# Altium project PCB Exericise.PrjPcb
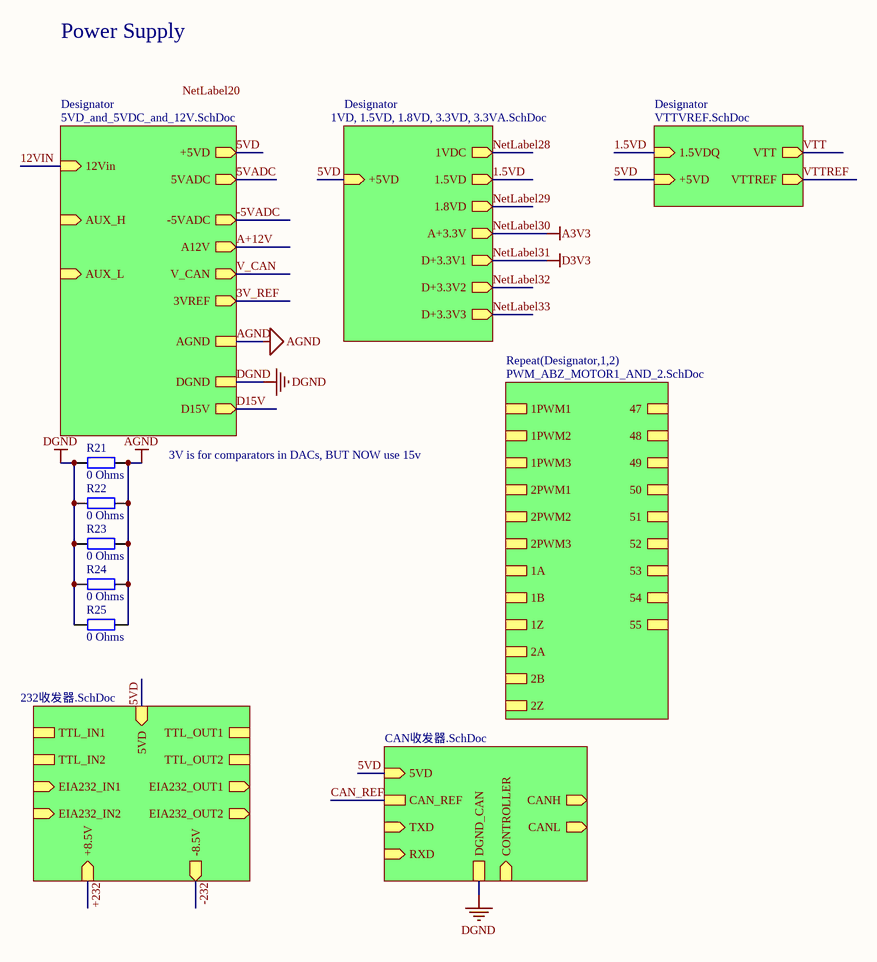
[diagram p0: POWER_BOARD.SchDoc]
10 sheets, 254 parts. Net scope: hierarchical (ports join the sheet entries above them; power ports are global).
Sheets:
  POWER_BOARD.SchDoc
    Designator = 1VD, 1.5VD, 1.8VD, 3.3VD, 3.3VA.SchDoc
    Designator = VTTVREF.SchDoc
    Designator = 5VD_and_5VDC_and_12V.SchDoc
    Designator = 232收发器.SchDoc
    CANH = CAN收发器.SchDoc
    Designator1 = PWM_ABZ_MOTOR1_AND_2.SchDoc
      ABZ1 = ABZ_M1_M2.SchDoc
      ABZ2 = ABZ_M1_M2.SchDoc
      ABZ3 = ABZ_M1_M2.SchDoc
      ABZ4 = ABZ_M1_M2.SchDoc
      ABZ5 = ABZ_M1_M2.SchDoc
      ABZ6 = ABZ_M1_M2.SchDoc
      ABZ7 = ABZ_M1_M2.SchDoc
      ABZ8 = ABZ_M1_M2.SchDoc
      ABZ9 = ABZ_M1_M2.SchDoc
      ABZ10 = ABZ_M1_M2.SchDoc
      ABZ11 = ABZ_M1_M2.SchDoc
      Drive1 = SN74HC245.SchDoc
      Drive2 = SN74HC245.SchDoc
      Drive3 = SN74HC245.SchDoc
      Drive4 = SN74HC245.SchDoc
      Drive5 = SN74HC245.SchDoc
    Designator2 = PWM_ABZ_MOTOR1_AND_2.SchDoc
      ABZ1 = ABZ_M1_M2.SchDoc
      ABZ2 = ABZ_M1_M2.SchDoc
      ABZ3 = ABZ_M1_M2.SchDoc
      ABZ4 = ABZ_M1_M2.SchDoc
      ABZ5 = ABZ_M1_M2.SchDoc
      ABZ6 = ABZ_M1_M2.SchDoc
      ABZ7 = ABZ_M1_M2.SchDoc
      ABZ8 = ABZ_M1_M2.SchDoc
      ABZ9 = ABZ_M1_M2.SchDoc
      ABZ10 = ABZ_M1_M2.SchDoc
      ABZ11 = ABZ_M1_M2.SchDoc
      Drive1 = SN74HC245.SchDoc
      Drive2 = SN74HC245.SchDoc
      Drive3 = SN74HC245.SchDoc
      Drive4 = SN74HC245.SchDoc
      Drive5 = SN74HC245.SchDoc
  PWM_M1_M2.SchDoc

## Sheet POWER_BOARD.SchDoc
size A4; SheetNumber: 1; SheetTotal: 10

### Parts
R21  0 Ohms  [R 0805_L]
R22  0 Ohms  [R 0805_L]
R23  0 Ohms  [R 0805_L]
R24  0 Ohms  [R 0805_L]
R25  0 Ohms  [R 0805_L]

### Sub-sheets
CANH = CAN收发器.SchDoc: 5VD (in), CAN_REF, TXD (in), RXD (in), CONTROLLER (in), CANL (out), CANH (out), DGND_CAN
Designator = 1VD, 1.5VD, 1.8VD, 3.3VD, 3.3VA.SchDoc: +5VD (in), 1VDC (out), 1.5VD (out), 1.8VD (out), A+3.3V (out), D+3.3V1 (out), D+3.3V2 (out), D+3.3V3 (out)
Designator = VTTVREF.SchDoc: 1.5VDQ (in), VTT (out), VTTREF (out), +5VD (in)
Designator = 5VD_and_5VDC_and_12V.SchDoc: +5VD (out), 12Vin (in), 5VADC (out), A12V (out), -5VADC (out), V_CAN (out), 3VREF (out), AGND, DGND, AUX_H (in), AUX_L (in), D15V (out)
Designator = 232收发器.SchDoc: TTL_IN1, TTL_IN2, TTL_OUT1, TTL_OUT2, +8.5V (in), EIA232_IN1 (in), EIA232_IN2 (in), EIA232_OUT1 (out), EIA232_OUT2 (out), 5VD (in), -8.5V (out)
Repeat(Designator,1,2) = PWM_ABZ_MOTOR1_AND_2.SchDoc: 1PWM1, 1PWM2, 1PWM3, 2PWM1, 2PWM2, 2PWM3, 1A, 1B, 1Z, 47, 48, 49, 50, 51, 52, 53, 54, 55, 2A, 2B, 2Z

### Nets
1.5VD: sheet Designator/1.5VD, sheet Designator/1.5VDQ
5VD: sheet Designator/+5VD, sheet Designator/+5VD, sheet Designator/+5VD, sheet Designator/5VD, sheet CANH/5VD
AGND: R21.2 R22.2 R23.2 R24.2 R25.2 ; sheet Designator/AGND
DGND: R21.1 R22.1 R23.1 R24.1 R25.1 ; sheet Designator/DGND, sheet CANH/DGND_CAN

### Notes on the sheet
- Power Supply
- 3V is for comparators in DACs, BUT NOW use 15v
- Labels drawn without touching a wire or pin: NetLabel20

### Library data of the parts
R21-R25 = R: 贴片电阻; 版权归属: 来自淘宝 ID：黄晶宝石; 封装库来自淘宝卖家 ID：黄晶宝石: 其他店铺购入均为盗版，不享受售后技术支持服务，请立即申请退款; BOM名称: 贴片电阻; 联系售后: https://shop463601444.taobao.com

## Sheet 1VD, 1.5VD, 1.8VD, 3.3VD, 3.3VA.SchDoc
size 381 x 241 mm; SheetNumber: 3; SheetTotal: 7
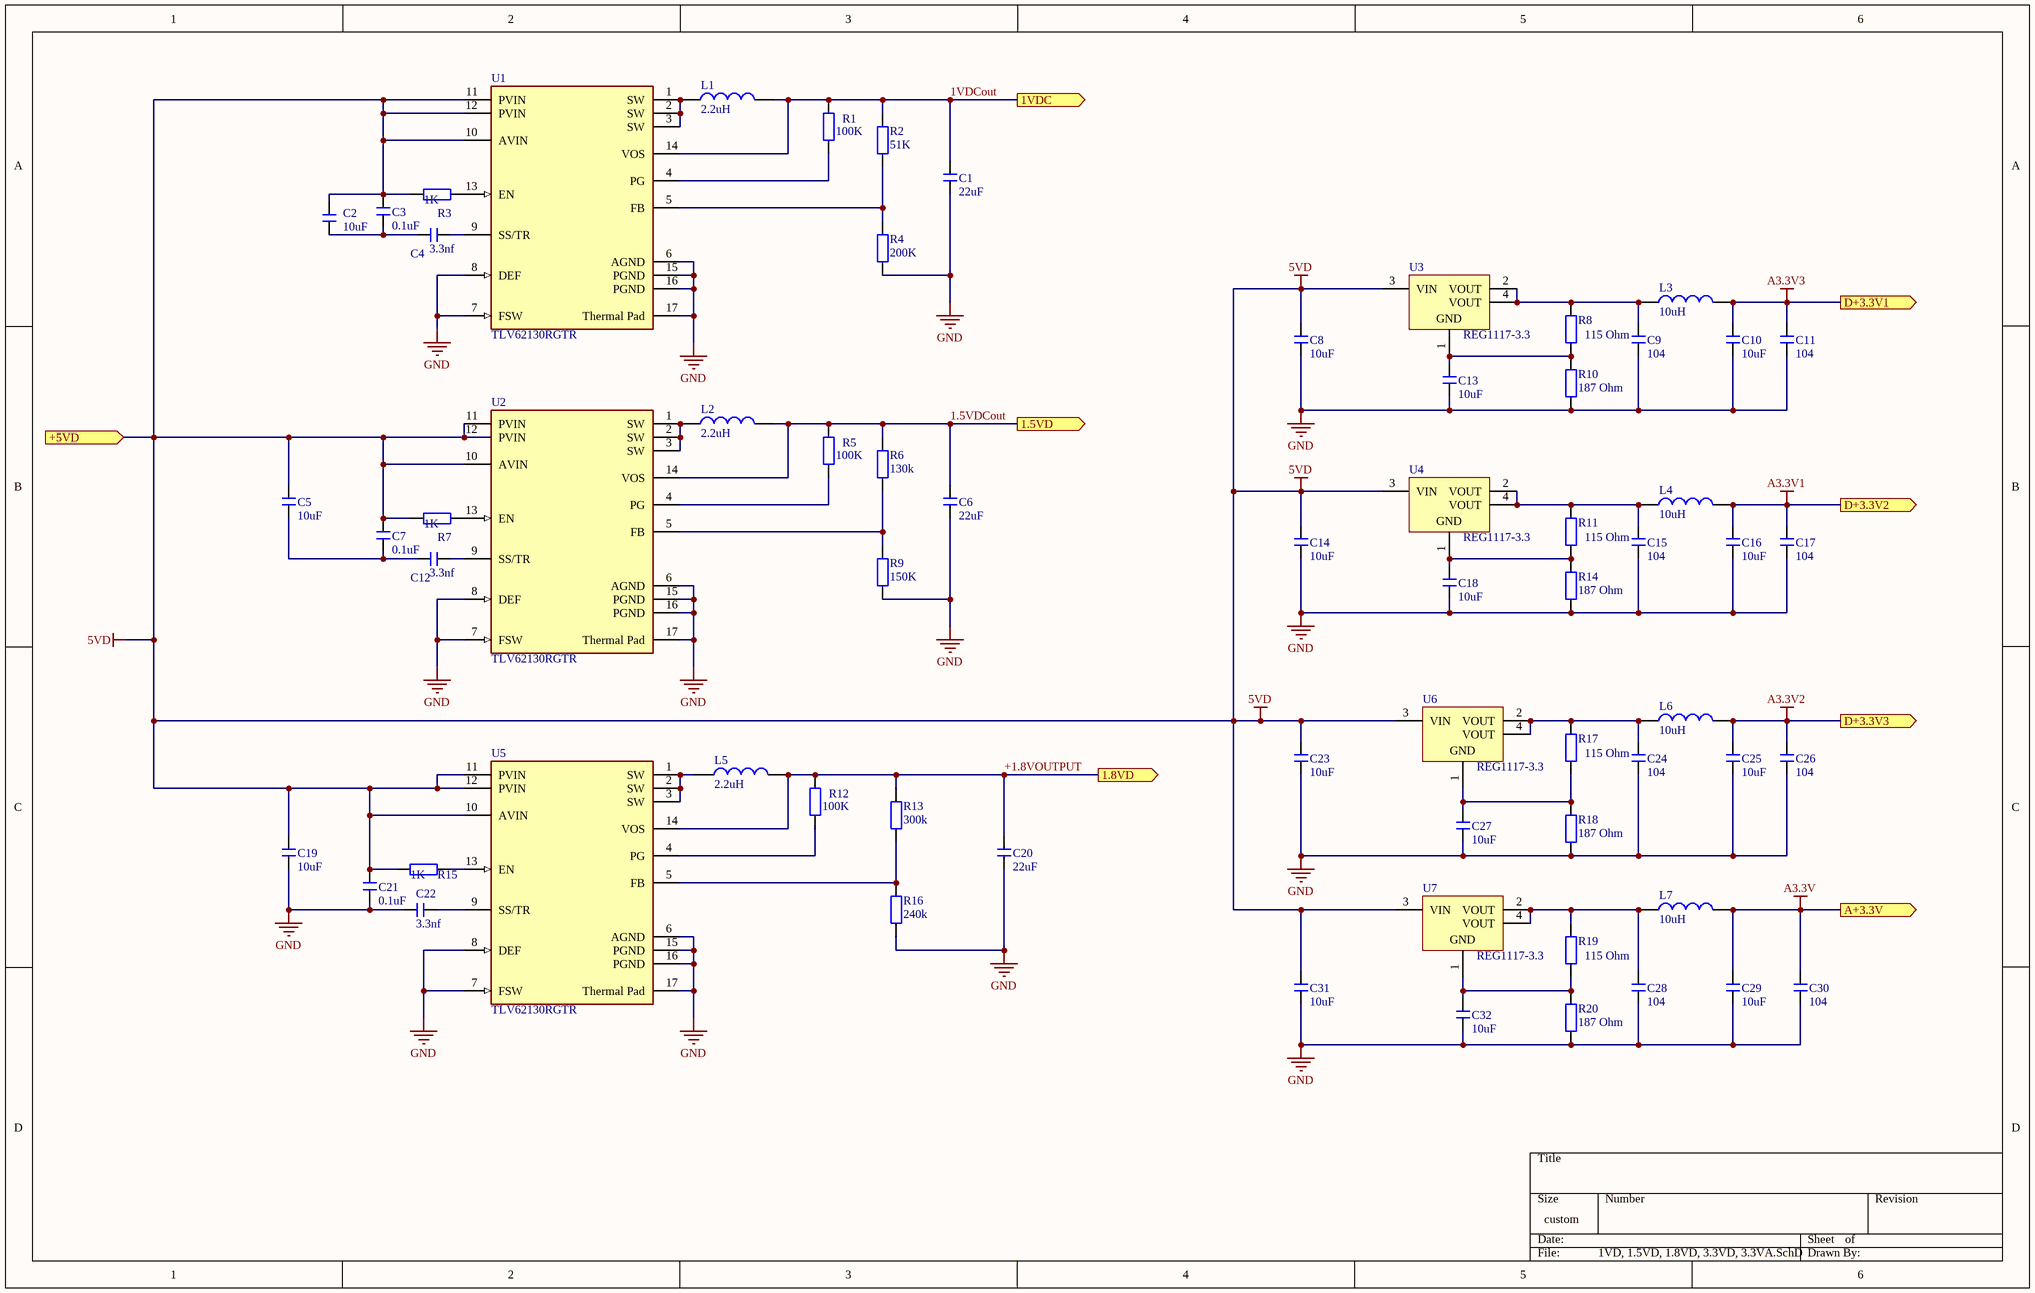
[diagram p1: 1VD, 1.5VD, 1.8VD, 3.3VD, 3.3VA.SchDoc]

### Parts
C1  22uF  [C 0805_L]
C2  10uF  [C 0805_L]
C3  0.1uF  [C 0805_L]
C4  3.3nf  [C 0805_L]
C5  10uF  [C 0805_L]
C6  22uF  [C 0805_L]
C7  0.1uF  [C 0805_L]
C8  10uF  [C 0805_L]
C9  104  [C 0805_L]
C10  10uF  [C 0805_L]
C11  104  [C 0805_L]
C12  3.3nf  [C 0805_L]
C13  10uF  [C 0805_L]
C14  10uF  [C 0805_L]
C15  104  [C 0805_L]
C16  10uF  [C 0805_L]
C17  104  [C 0805_L]
C18  10uF  [C 0805_L]
C19  10uF  [C 0805_L]
C20  22uF  [C 0805_L]
C21  0.1uF  [C 0805_L]
C22  3.3nf  [C 0805_L]
C23  10uF  [C 0805_L]
C24  104  [C 0805_L]
C25  10uF  [C 0805_L]
C26  104  [C 0805_L]
C27  10uF  [C 0805_L]
C28  104  [C 0805_L]
C29  10uF  [C 0805_L]
C30  104  [C 0805_L]
C31  10uF  [C 0805_L]
C32  10uF  [C 0805_L]
L1  2.2uH  [L 0805]
L2  2.2uH  [L 0805]
L3  10uH  [AL0307]
L4  10uH  [AL0307]
L5  2.2uH  [L 0805]
L6  10uH  [AL0307]
L7  10uH  [AL0307]
R1  100K  [R 0805_L]
R2  51K  [R 0805_L]
R3  1K  [R 0805_L]
R4  200K  [R 0805_L]
R5  100K  [R 0805_L]
R6  130k  [R 0805_L]
R7  1K  [R 0805_L]
R8  115 Ohm  [R 0805_L]
R9  150K  [R 0805_L]
R10  187 Ohm  [R 0805_L]
R11  115 Ohm  [R 0805_L]
R12  100K  [R 0805_L]
R13  300k  [R 0805_L]
R14  187 Ohm  [R 0805_L]
R15  1K  [R 0805_L]
R16  240k  [R 0805_L]
R17  115 Ohm  [R 0805_L]
R18  187 Ohm  [R 0805_L]
R19  115 Ohm  [R 0805_L]
R20  187 Ohm  [R 0805_L]
U1  TLV62130RGTR  [FP-RGT0016C-IPC_A]
U2  TLV62130RGTR  [FP-RGT0016C-IPC_A]
U3  REG1117-3.3  [DCY0004A_M]
U4  REG1117-3.3  [DCY0004A_M]
U5  TLV62130RGTR  [FP-RGT0016C-IPC_A]
U6  REG1117-3.3  [DCY0004A_M]
U7  REG1117-3.3  [DCY0004A_M]

### Ports
1.5VD (out, see POWER_BOARD[2A]), 1.8VD (out, see POWER_BOARD[2A]), 1VDC (out, see POWER_BOARD[2A]), +5VD (in, see POWER_BOARD[1A], 5VD_and_5VDC_and_12V[3B], VTTVREF[1B]), A+3.3V (out, see POWER_BOARD[2B]), D+3.3V1 (out, see POWER_BOARD[2B]), D+3.3V2 (out, see POWER_BOARD[2B]), D+3.3V3 (out, see POWER_BOARD[2B])

### Nets
1.5VDCout: C6.2 L2.2 R5.2 R6.2 U2.14(VOS) ; port 1.5VD  [project net 1.5VD]
5VD: C2.2 C3.2 C5.2 C7.2 C8.2 C14.2 C19.2 C21.2 C23.2 C31.2 R3.1 R7.1 R15.1 U1.10(AVIN) U1.11(PVIN) U1.12(PVIN) U2.10(AVIN) U2.11(PVIN) U2.12(PVIN) U3.3(VIN) U4.3(VIN) U5.10(AVIN) U5.11(PVIN) U5.12(PVIN) U6.3(VIN) U7.3(VIN) ; port +5VD
A3.3V: C29.2 C30.2 L7.2 ; port A+3.3V  [project net NetLabel30]
A3.3V1: C16.2 C17.2 L4.2 ; port D+3.3V2  [project net NetLabel32]
A3.3V2: C25.2 C26.2 L6.2 ; port D+3.3V3  [project net NetLabel33]
A3.3V3: C10.2 C11.2 L3.2 ; port D+3.3V1  [project net 1A_IN]
GND: C1.1 C6.1 C8.1 C9.1 C10.1 C11.1 C13.1 C14.1 C15.1 C16.1 C17.1 C18.1 C19.1 C20.1 C21.1 C22.1 C23.1 C24.1 C25.1 C26.1 C27.1 C28.1 C29.1 C30.1 C31.1 C32.1 R4.1 R9.1 R10.1 R14.1 R16.1 R18.1 R20.1 U1.6(AGND) U1.7(FSW) U1.8(DEF) U1.15(PGND) U1.16(PGND) U1.17(Thermal_Pad) U2.6(AGND) U2.7(FSW) U2.8(DEF) U2.15(PGND) U2.16(PGND) U2.17(Thermal_Pad) U5.6(AGND) U5.7(FSW) U5.8(DEF) U5.15(PGND) U5.16(PGND) U5.17(Thermal_Pad)
1VDCout: C1.2 L1.2 R1.2 R2.2 U1.14(VOS) ; port 1VDC
+1.8VOUTPUT: C20.2 L5.2 R12.2 R13.2 U5.14(VOS) ; port 1.8VD
NetC2_1: C2.1 C3.1 C4.1
NetC4_2: C4.2 U1.9(SS/TR)
NetC5_1: C5.1 C7.1 C12.1
NetC9_2: C9.2 L3.1 R8.2 U3.2(VOUT) U3.4(VOUT)
NetC12_2: C12.2 U2.9(SS/TR)
NetC13_2: C13.2 R8.1 R10.2 U3.1(GND)
NetC15_2: C15.2 L4.1 R11.2 U4.2(VOUT) U4.4(VOUT)
NetC18_2: C18.2 R11.1 R14.2 U4.1(GND)
NetC22_2: C22.2 U5.9(SS/TR)
NetC24_2: C24.2 L6.1 R17.2 U6.2(VOUT) U6.4(VOUT)
NetC27_2: C27.2 R17.1 R18.2 U6.1(GND)
NetC28_2: C28.2 L7.1 R19.2 U7.2(VOUT) U7.4(VOUT)
NetC32_2: C32.2 R19.1 R20.2 U7.1(GND)
NetL1_1: L1.1 U1.1(SW) U1.2(SW) U1.3(SW)
NetL2_1: L2.1 U2.1(SW) U2.2(SW) U2.3(SW)
NetL5_1: L5.1 U5.1(SW) U5.2(SW) U5.3(SW)
NetR1_1: R1.1 U1.4(PG)
NetR2_1: R2.1 R4.2 U1.5(FB)
NetR3_2: R3.2 U1.13(EN)
NetR5_1: R5.1 U2.4(PG)
NetR6_1: R6.1 R9.2 U2.5(FB)
NetR7_2: R7.2 U2.13(EN)
NetR12_1: R12.1 U5.4(PG)
NetR13_1: R13.1 R16.2 U5.5(FB)
NetR15_2: R15.2 U5.13(EN)

### Library data of the parts
C1 C6 = C: 贴片电容 22 µF, 6.3 V, Ceramic, 0805 Standard; BOM名称: 无极性贴片电容; 淘宝ID: 封装库来自淘宝 ID：黄晶宝石; 联系售后，技术支持: https://shop463601444.taobao.com; 唯一出售店铺网址: https://shop463601444.taobao.com
C2 C5 = C: 贴片电容 10 µF, 25 V, Ceramic, 1210 Standard; BOM名称: 无极性贴片电容; 淘宝ID: 封装库来自淘宝 ID：黄晶宝石; 联系售后，技术支持: https://shop463601444.taobao.com; 唯一出售店铺网址: https://shop463601444.taobao.com
C3 = C: 贴片电容 / C7 0.1 µF, 25V, Ceramic, 0603; BOM名称: 无极性贴片电容; 淘宝ID: 封装库来自淘宝 ID：黄晶宝石; 联系售后，技术支持: https://shop463601444.taobao.com; 唯一出售店铺网址: https://shop463601444.taobao.com
C4 C12 C22 = C: 贴片电容 3300 pF, 25 V, Ceramic, 0603; BOM名称: 无极性贴片电容; 淘宝ID: 封装库来自淘宝 ID：黄晶宝石; 联系售后，技术支持: https://shop463601444.taobao.com; 唯一出售店铺网址: https://shop463601444.taobao.com
C7 = C: 贴片电容 0.1 µF, 25V, Ceramic, 0603; BOM名称: 无极性贴片电容; 淘宝ID: 封装库来自淘宝 ID：黄晶宝石; 联系售后，技术支持: https://shop463601444.taobao.com; 唯一出售店铺网址: https://shop463601444.taobao.com
C8-C11 C13-C18 C21 C23-C32 = C: 贴片电容; BOM名称: 无极性贴片电容; 淘宝ID: 封装库来自淘宝 ID：黄晶宝石; 联系售后，技术支持: https://shop463601444.taobao.com; 唯一出售店铺网址: https://shop463601444.taobao.com
C19 = C: 贴片电容 10 µF, 25 V, Ceramic, 1210; BOM名称: 无极性贴片电容; 淘宝ID: 封装库来自淘宝 ID：黄晶宝石; 联系售后，技术支持: https://shop463601444.taobao.com; 唯一出售店铺网址: https://shop463601444.taobao.com
C20 = C: 贴片电容 22 µF, 6.3 V, Ceramic, 0805; BOM名称: 无极性贴片电容; 淘宝ID: 封装库来自淘宝 ID：黄晶宝石; 联系售后，技术支持: https://shop463601444.taobao.com; 唯一出售店铺网址: https://shop463601444.taobao.com
L1 L2 = L: 小功率贴片电感 2.2 µH, 0.165 × 0.165 in XFL4020-222MEB, Coilcraft; 淘宝ID: 封装库来自淘宝 ID：黄晶宝石; 封装库来自淘宝卖家 ID：黄晶宝石: 其他店铺购入均为盗版，不享受售后技术支持服务，请立即申请退款; BOM名称: 小功率贴片电感; 联系售后: https://shop463601444.taobao.com
L3 L4 L6 L7 = L-AL: 色环电感; 淘宝ID: 封装库来自淘宝 ID：黄晶宝石; BOM名称: 色环电感; 学习资源: https://shop463601444.taobao.com
L5 = L: 小功率贴片电感; 淘宝ID: 封装库来自淘宝 ID：黄晶宝石; 封装库来自淘宝卖家 ID：黄晶宝石: 其他店铺购入均为盗版，不享受售后技术支持服务，请立即申请退款; BOM名称: 小功率贴片电感; 联系售后: https://shop463601444.taobao.com
R1 R5 = R: 贴片电阻 100 kΩ, Chip, 0603, 1/16W, 1%; 版权归属: 来自淘宝 ID：黄晶宝石; 封装库来自淘宝卖家 ID：黄晶宝石: 其他店铺购入均为盗版，不享受售后技术支持服务，请立即申请退款; BOM名称: 贴片电阻; 联系售后: https://shop463601444.taobao.com
R2 R4 R6 R8-R14 R16-R20 = R: as R21 on sheet POWER_BOARD; BOM名称: 贴片电阻; 联系售后: https://shop463601444.taobao.com
R3 R7 R15 = R: 贴片电阻R1 IMPORTANT, TO PREVENT HV DAMAGE; BOM名称: 贴片电阻; 版权归属: 来自淘宝 ID：黄晶宝石; 封装库来自淘宝卖家 ID：黄晶宝石: 其他店铺购入均为盗版，不享受售后技术支持服务，请立即申请退款; 联系售后: https://shop463601444.taobao.com
U1 U2 U5 = CMP-04918-000039-1: IC REG BUCK ADJUSTABLE 3A 16QFN; Manufacturer: Texas Instruments; Min Supply Voltage: 3V; Max Junction Temp: +125°C; Output Type: AdjustableProgrammable; Number Of Outputs: 1; Nominal Supply Current: 19uA; Standoff Height: 0mm; Max Supply Voltage: 17V; Switching Frequency: 1.25/2.5MHz; Max Duty Cycle: 100%; Output Voltage: 0.9-5.5V; ComponentLink2Description: Datasheet; Category: IC; Manufacturer Part Number: TLV62130RGTR; Mouser Description: Switching Voltage Regulators 4-17V 3A Step-Down Converter; Output Current: 3A; Ambient Temperature Range Low: -40°C; Package: RGT0016C; Lead Free: Yes; Temperature Range Low: -40°C; Digikey Description: IC REG BUCK ADJUSTABLE 3A 16QFN; Height: 1mm; Device Class L3: Voltage Regulators - Switching; Device Class L1: Integrated Circuits (ICs); Switching Topology: Buck; Ambient Temperature Range High: +85°C; RoHS: TRUE; Ipc Land Pattern Name: QFN50P300X300X100-16; Temperature: -40°C to +85°C; Octopart: https://octopart.com/tlv62130rgtr-texas+instruments-21766117; Device Class L2: Power Management ICs; Temperature Range High: +85°C; Automotive: No; ComponentLink2URL: http://www.ti.com/lit/ds/symlink/tlv62130.pdf
U3 U4 U6 U7 = CMP-0395-00549-2: Single Output LDO, 800 mA, Fixed 3.3 V Output, 3.8 to 15 V Input, with Internal Current Limiting, 4-pin SOT-223 (DCY), -40 to 125 degC, Green (RoHS & no Sb/Br); Manufacturer: Texas Instruments; Vout Adj(Max)(V): 3.3; Vin(Max)(V): 15; Iq(Typ)(mA): 4; Iout(Max)(A): 0.8; Vdo(Typ)(mV): 1100; Vin(Min)(V): 3.8; SubFamily: Single Channel LDO; Rating: Catalog; Fixed Output Options(V): 5; ComponentLink1Description: Manufacturer URL; Eco-Plan: Green (RoHS & no Sb/Br); PackageReference: DCY0004A; Mounting Technology: Surface Mount; ComponentLink3Description: Package Specification; Vout Adj(Min)(V): 3.3; ComponentLink2URL: http://www.ti.com/general/docs/lit/getliterature.tsp?genericPartNumber=REG1117-33&fileType=pdf; PackageVersion: 4202506/B; ComponentLink3URL: http://www.ti.com/litv/pdf/mpds094a; Code_JEDEC: TO-261; ComponentLink1URL: http://www.ti.com/; ComponentLink2Description: Datasheet; PartNumber: REG1117-3.3; DatasheetVersion: SBVS001D; PackageDescription: 4-Pin Plastic Small Outline, Body 3.5 x 6.5 mm, Pitch 2.3 mm

## Sheet VTTVREF.SchDoc
size A4; SheetNumber: 4; SheetTotal: 5
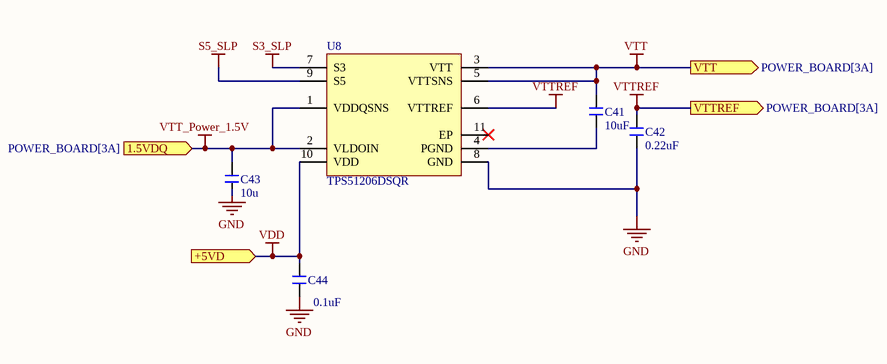
[diagram p2: VTTVREF.SchDoc]

### Parts
C41  10uF  [C 0805_L]
C42  0.22uF  [C 0805_L]
C43  10u  [C 0805_L]
C44  0.1uF  [C 0805_L]
U8  TPS51206DSQR  [DSQ0010A_V]

### Ports
1.5VDQ (in, see POWER_BOARD[3A]), +5VD (in, see POWER_BOARD[3A], 1VD, 1.5VD, 1.8VD, 3.3VD, 3.3VA[1B], 5VD_and_5VDC_and_12V[3B]), VTT (out, see POWER_BOARD[3A]), VTTREF (out, see POWER_BOARD[3A])

### Nets
GND: C42.1 C43.1 C44.1 U8.8(GND)
S3_SLP: U8.7(S3)
S5_SLP: U8.9(S5)
VDD: C44.2 U8.10(VDD) ; port +5VD  [project net 5VD]
VTT: C41.2 U8.3(VTT) U8.5(VTTSNS) ; port VTT
VTT_Power_1.5V: C43.2 U8.1(VDDQSNS) U8.2(VLDOIN) ; port 1.5VDQ  [project net 1.5VD]
VTTREF: C42.2 U8.6(VTTREF) ; port VTTREF
NetC41_1: C41.1 U8.4(PGND)

Not connected (* = marked no-connect by the designer): U8 11(EP)*

### Library data of the parts
C41 = C: 贴片电容 10 µF, 6.3 V, X5R, 1608 (0603),  JMK107BJ106MA; BOM名称: 无极性贴片电容; 淘宝ID: 封装库来自淘宝 ID：黄晶宝石; 联系售后，技术支持: https://shop463601444.taobao.com; 唯一出售店铺网址: https://shop463601444.taobao.com
C42 = C: 贴片电容 C4 0.22 µF, 6.3 V, X5R, 1005 (0402) Taiyo Yuden JMK105BJ224KV; BOM名称: 无极性贴片电容; 淘宝ID: 封装库来自淘宝 ID：黄晶宝石; 联系售后，技术支持: https://shop463601444.taobao.com; 唯一出售店铺网址: https://shop463601444.taobao.com
C43 = C: 贴片电容 10 µF, 6.3 V, X5R, 1608 (0603) Taiyo Yuden JMK107BJ106MA; BOM名称: 无极性贴片电容; 淘宝ID: 封装库来自淘宝 ID：黄晶宝石; 联系售后，技术支持: https://shop463601444.taobao.com; 唯一出售店铺网址: https://shop463601444.taobao.com
C44 = C: 贴片电容 0.1 µF, 6.3 V, X5R, 1005 (0402) Taiyo Yuden JWK105BJ104MP; BOM名称: 无极性贴片电容; 淘宝ID: 封装库来自淘宝 ID：黄晶宝石; 联系售后，技术支持: https://shop463601444.taobao.com; 唯一出售店铺网址: https://shop463601444.taobao.com
U8 = CMP-0395-00678-2: Single Output LDO, 2 A, with VTTREF Buffered Reference for DDR2, DDR3, DDR3L, 10-pin SON (DSQ), -40 to 85 degC, Green (RoHS & no Sb/Br); Manufacturer: Texas Instruments; SubFamily: Single Channel LDO; Iout(Max)(A): 2; Rating: Catalog; ComponentLink2Description: Datasheet; ComponentLink1URL: http://www.ti.com/; ComponentLink4URL: Samples URL:http://www.ti.com/product/tps51206#samples; PackageVersion: 4209243/B; Mounting Technology: Surface Mount; PackageReference: DSQ0010A; Eco-Plan: Green (RoHS & no Sb/Br); PackageDescription: 10-Pin Plastic Small Outline, Body 2 X 2 mm, Pitch 0.4 mm; ComponentLink4Description: URL Link1; DatasheetVersion: SLUSAH1; ComponentLink3URL: http://www.ti.com/litv/pdf/mpdi002c; ComponentLink2URL: http://www.ti.com/general/docs/lit/getliterature.tsp?genericPartNumber=TPS51206&fileType=pdf; PartNumber: TPS51206DSQR; ComponentLink3Description: Package Specification; ComponentLink1Description: Manufacturer URL

## Sheet 5VD_and_5VDC_and_12V.SchDoc
size A4; SheetNumber: 2; SheetTotal: 7
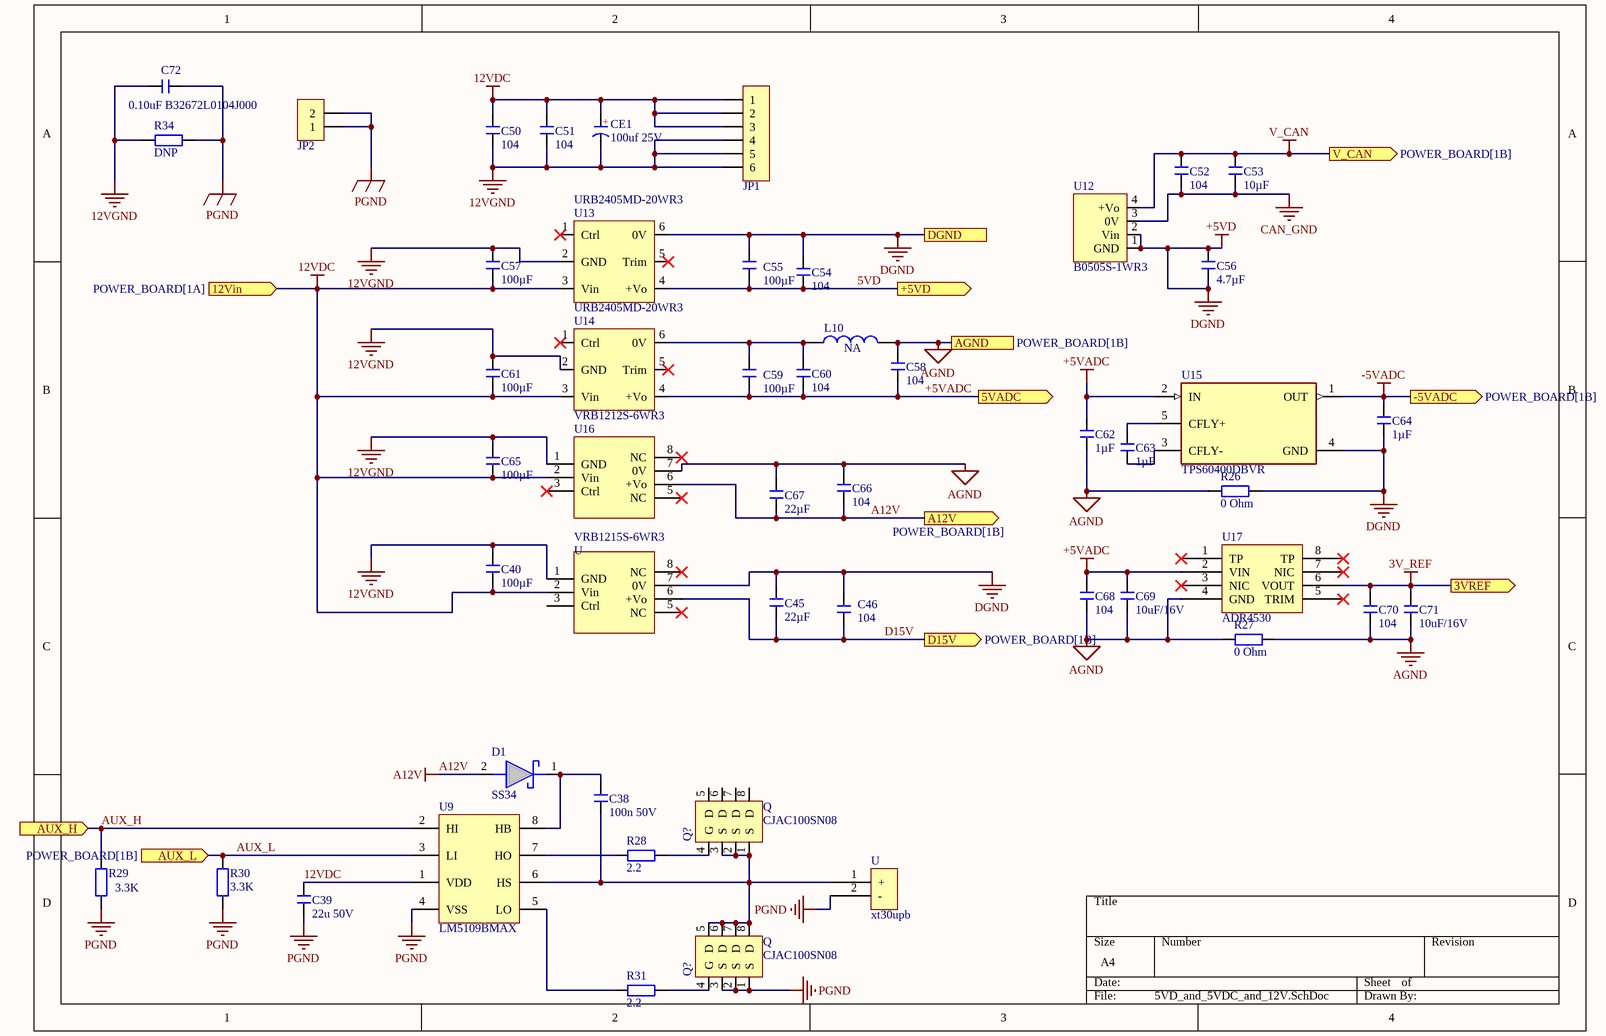
[diagram p3: 5VD_and_5VDC_and_12V.SchDoc]

### Parts
(Parts that share a designator on the sheet are numbered #1, #2 ... from top to bottom, then left to right.)
C38  100n 50V  [C 0805_L]
C39  22u 50V  [C 0805_L]
C40  100µF  [C 0805_L]
C45  22µF  [C 0805_L]
C46  104  [C 0805_L]
C50  104  [C 0805_L]
C51  104  [C 0805_L]
C52  104  [C 0805_L]
C53  10µF  [C 0805_L]
C54  104  [C 0805_L]
C55  100µF  [C 0805_L]
C56  4.7µF  [C 0805_L]
C57  100µF  [C 0805_L]
C58  104  [C 0805_L]
C59  100µF  [C 0805_L]
C60  104  [C 0805_L]
C61  100µF  [C 0805_L]
C62  1µF  [C 0805_L]
C63  1µF  [C 0805_L]
C64  1µF  [C 0805_L]
C65  100µF  [C 0805_L]
C66  104  [C 0805_L]
C67  22µF  [C 0805_L]
C68  104  [C 0805_L]
C69  10uF/16V  [C 0805_L]
C70  104  [C 0805_L]
C71  10uF/16V  [C 0805_L]
C72  0.10uF B32672L0104J000  [C 0805_L]
CE1  100uf 25V  [CAP 1.5*4*8]
D1  SS34  [DIOM8059X256N]
JP1  HDR-1X6  [KF128-3.81-6P]  (value not drawn)
JP2  HDR-1X2  [KF7620-2P]  (value not drawn)
L10  NA  [L 0805]
Q#1  CJAC100SN08
Q#2  CJAC100SN08
R26  0 Ohm  [R 0805_L]
R27  0 Ohm  [R 0805_L]
R28  2.2  [R 0805_L]
R29  3.3K  [R 0805_L]
R30  3.3K  [R 0805_L]
R31  2.2  [R 0805_L]
R34  DNP  [R 0805_L]
U9  LM5109BMAX  [M08A_M]
U12  B0505S-1WR3
U13  URB2405MD-20WR3  [URB_YMD-20WR3]
U14  URB2405MD-20WR3  [URB_YMD-20WR3]
U15  TPS60400DBVR  [FP-DBV0005A-MFG]
U16  VRB1212S-6WR3
U17  ADR4530
U#1  VRB1215S-6WR3
U#2  xt30upb

### Ports
3VREF (out, see POWER_BOARD[1B]), 5VADC (out, see POWER_BOARD[1A]), 12Vin (in, see POWER_BOARD[1A]), +5VD (out, see POWER_BOARD[1A], 1VD, 1.5VD, 1.8VD, 3.3VD, 3.3VA[1B], VTTVREF[1B]), -5VADC (out, see POWER_BOARD[1B]), A12V (out, see POWER_BOARD[1B]), AGND (see POWER_BOARD[1B]), AUX_H (in, see POWER_BOARD[1B]), AUX_L (in, see POWER_BOARD[1B]), D15V (out, see POWER_BOARD[1B]), DGND (see POWER_BOARD[1B]), V_CAN (out, see POWER_BOARD[1B])

### Nets
3V_REF: C70.2 C71.2 U17.6(VOUT) ; port 3VREF
5VD: C54.1 C55.1 U13.4(+Vo) ; port +5VD
12VDC: C39.2 C40.1 C50.1 C51.1 C57.2 C61.2 C65.1 CE1.1(A) JP1.1 JP1.2 JP1.3 U9.1(VDD) U13.3(Vin) U14.3(Vin) U16.2(Vin) U#1.2(Vin) ; port 12Vin
12VGND: C40.2 C50.2 C51.2 C57.1 C61.1 C65.2 C72.1 CE1.2(K) JP1.4 JP1.5 JP1.6 R34.1 U13.2(GND) U14.2(GND) U16.1(GND) U#1.1(GND)
+5VADC: C58.1 C59.1 C60.2 C62.2 C68.2 C69.2 U14.4(+Vo) U15.2(IN) U17.2(VIN) ; port 5VADC
-5VADC: C64.2 U15.1(OUT) ; port -5VADC
A12V: C66.1 C67.2 D1.2(A) U16.6(+Vo) ; port A12V  [project net A+12V]
AGND: C58.2 C62.1 C66.2 C67.1 C68.1 C69.1 C70.1 C71.1 L10.2 R26.1 R27.1 R27.2 U16.7(0V) U17.4(GND) ; port AGND
CAN_GND: C52.1 C53.1 U12.3(0V)
DGND: C45.1 C46.2 C54.2 C55.2 C56.1 C56.2 C64.1 R26.2 U12.1(GND) U12.2(Vin) U13.6(0V) U15.4(GND) U#1.7(0V) ; port DGND  [also labelled +5VD]
PGND: C39.1 C72.2 JP2.1 JP2.2 Q#2.1(S) Q#2.2(S) Q#2.3(S) R29.1 R30.1 R34.2 U9.4(VSS) U#2.2(-)
V_CAN: C52.2 C53.2 U12.4(+Vo) ; port V_CAN
AUX_H: R29.2 U9.2(HI) ; port AUX_H
AUX_L: R30.2 U9.3(LI) ; port AUX_L
D15V: C45.2 C46.1 U#1.6(+Vo) ; port D15V
NetC38_1: C38.1 Q#1.1(S) Q#1.2(S) Q#1.3(S) Q#2.5(D) Q#2.6(D) Q#2.7(D) Q#2.8(D) U9.6(HS) U#2.1(+)
NetC38_2: C38.2 D1.1(K) U9.8(HB)
NetC59_2: C59.2 C60.1 L10.1 U14.6(0V)
NetC63_1: C63.1 U15.3(CFLY-)
NetC63_2: C63.2 U15.5(CFLY+)
NetQ#1_4: Q#1.4(G) R28.2
NetQ#2_4: Q#2.4(G) R31.2
NetR28_1: R28.1 U9.7(HO)
NetR31_1: R31.1 U9.5(LO)

Not connected (* = marked no-connect by the designer): Q#1 5(D) 6(D) 7(D) 8(D); U13 1(Ctrl)* 5(Trim)*; U14 1(Ctrl)* 5(Trim)*; U16 3(Ctrl)* 5(NC)* 8(NC)*; U17 1(TP)* 3(NIC)* 5(TRIM)* 7(NIC)* 8(TP)*; U#1 3(Ctrl) 5(NC)* 8(NC)*

### Notes on the sheet
- (in symbol CE) +
- (in symbol CJAC100SN08) Q?

### Library data of the parts
C38 C39 C46 C50-C52 C54 C58 C60 C66 C68-C71 = C: as C8 on sheet 1VD, 1.5VD, 1.8VD, 3.3VD, 3.3VA; 联系售后，技术支持: https://shop463601444.taobao.com; 唯一出售店铺网址: https://shop463601444.taobao.com
C40 C57 C61-C65 = C: 贴片电容 100µF/50V; BOM名称: 无极性贴片电容; 淘宝ID: 封装库来自淘宝 ID：黄晶宝石; 联系售后，技术支持: https://shop463601444.taobao.com; 唯一出售店铺网址: https://shop463601444.taobao.com
C45 C67 = C: 贴片电容 22µF/50V; BOM名称: 无极性贴片电容; 淘宝ID: 封装库来自淘宝 ID：黄晶宝石; 联系售后，技术支持: https://shop463601444.taobao.com; 唯一出售店铺网址: https://shop463601444.taobao.com
C53 = C: 贴片电容 10µF/16V; BOM名称: 无极性贴片电容; 淘宝ID: 封装库来自淘宝 ID：黄晶宝石; 联系售后，技术支持: https://shop463601444.taobao.com; 唯一出售店铺网址: https://shop463601444.taobao.com
C55 C59 = C: 贴片电容 100µF/16V; BOM名称: 无极性贴片电容; 淘宝ID: 封装库来自淘宝 ID：黄晶宝石; 联系售后，技术支持: https://shop463601444.taobao.com; 唯一出售店铺网址: https://shop463601444.taobao.com
C56 = C: 贴片电容 4.7µF/16V; BOM名称: 无极性贴片电容; 淘宝ID: 封装库来自淘宝 ID：黄晶宝石; 联系售后，技术支持: https://shop463601444.taobao.com; 唯一出售店铺网址: https://shop463601444.taobao.com
C72 = C: through hole电容 薄膜電容器 FILM CAP MKP BOX 0.10uF 5% 1000V LS 15mm; BOM名称: 无极性贴片电容; 淘宝ID: 封装库来自淘宝 ID：黄晶宝石; 联系售后，技术支持: https://shop463601444.taobao.com; 唯一出售店铺网址: https://shop463601444.taobao.com
CE1 = CE: 直插电解电容  贴片铝电,d=6MM; 淘宝ID: 封装库来自淘宝 ID：黄晶宝石; BOM名称: 直插电解电容; 联系售后: https://shop463601444.taobao.com
D1 = SS34: ON Semi SS34 SMT Schottky Diode, 40V 3A, 2-Pin DO-214AB; Manufacturer_Name: onsemi; Geometry.Height: 2.56mm; Mouser Part Number: 512-SS34; Mouser Price/Stock: https://www.mouser.co.uk/ProductDetail/onsemi-Fairchild/SS34?qs=2ONuHmP%2FXzb3ub11UdFfdQ%3D%3D; Manufacturer_Part_Number: SS34; Datasheet Link: https://componentsearchengine.com/Datasheets/2/SS34.pdf
JP1 = Header 6: 6P接插件 3.81; 版权归属: 源创客; BOM名称: 6P接插件; 学习资源: www.ooocke.com
JP2 = Header 2: 2P接插件; 版权归属: 封装库来自淘宝 ID：黄晶宝石; BOM名称: 2P接插件; 技术支持，联系售后: https://shop463601444.taobao.com
L10 = L: 小功率贴片电感 CIB31P310 31 Ohms @ 100 MHz; 淘宝ID: 封装库来自淘宝 ID：黄晶宝石; 封装库来自淘宝卖家 ID：黄晶宝石: 其他店铺购入均为盗版，不享受售后技术支持服务，请立即申请退款; BOM名称: 小功率贴片电感; 联系售后: https://shop463601444.taobao.com
R26-R31 R34 = R: as R21 on sheet POWER_BOARD; BOM名称: 贴片电阻; 联系售后: https://shop463601444.taobao.com
U9 = CMP-0063-00512-2: High Voltage 1A Peak Half Bridge Gate Driver, 8-pin Narrow SOIC; Manufacturer: National Semiconductor; PowerWise: N; PackageTopMarking: NSZXTT*L5109*BMA; CompType: MiscPower; ComponentLink2URL: http://www.national.com/pf/LM/LM5109B.html; PackageReference: M08A; Code_IPC: SOIC127P600-8; ComponentLink1Description: LM5109B Datasheet; ComponentLink1URL: http://www.national.com/ds/LM/LM5109B.pdf; ComponentLink3Description: M08A Package Page; RoHS: N; ComponentLink3URL: http://www.national.com/packaging/folders/m08a.html; ComponentLink2Description: LM5109B Web Page; DatasheetVersion: Feb-2007; PinCount: 8; RevisionNote: Component URLs added; Code_JEDEC: MS-012-AA; PackageVersion: revM, May-2009; PackageDescription: SOIC Narrow, 4.9 x 3.9 x 1.45mm, 8 Lead, 1.27mm Pitch
U12 = B_S-1WR3
U13 U14 = URB_YMD-20WR3
U15 = CMP-0391-00019-3: IC REG CHARG PUMP INV 60MA SOT23; Number of Outputs: 1; Min Supply Voltage: 1.8V; Max Supply Voltage: 5.25V; Max Output Voltage: -5.25V; Operating Supply Current: 125uA; Logic Function: Inverting; Min Output Voltage: -1.6V; Output Type: Adjustable; Switching Frequency: 250kHz; Synchronous Rectifier: No; Min Operating Temperature: -40°C; Number of Pins: 5; Package Quantity: 3000; Min Input Voltage: 1.8V; Max Operating Temperature: 85°C; Packaging: Tape and Reel; Output Current: 60mA; Max Input Voltage: 5.25V; Weight: 0.000459oz; Lead Free: Lead Free; Output Voltage: -5.25V; Contact Plating: Gold; Radiation Hardening: No; Quiescent Current: 125uA; Max Output Current: 60mA; REACH SVHC: No SVHC; Case/Package: SOT-23-5
U16 U#1 = VRB_S-6WR3
U17 = ADR4530: 3V Voltage Reference from Analog Devices

## Sheet 232收发器.SchDoc
size A4; SheetNumber: 5; SheetTotal: 7
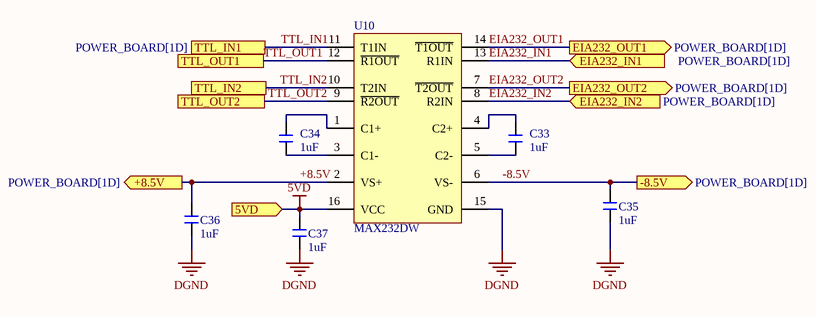
[diagram p4: 232收发器.SchDoc]

### Parts
C33  1uF  [C 0805_L]
C34  1uF  [C 0805_L]
C35  1uF  [C 0805_L]
C36  1uF  [C 0805_L]
C37  1uF  [C 0805_L]
U10  MAX232DW  [DW0016A_N]

### Ports
5VD (in, see POWER_BOARD[1C], CAN收发器[1A]), +8.5V (out, see POWER_BOARD[1D]), -8.5V (out, see POWER_BOARD[1D]), EIA232_IN1 (in, see POWER_BOARD[1D]), EIA232_IN2 (in, see POWER_BOARD[1D]), EIA232_OUT1 (out, see POWER_BOARD[1D]), EIA232_OUT2 (out, see POWER_BOARD[1D]), TTL_IN1 (see POWER_BOARD[1D]), TTL_IN2 (see POWER_BOARD[1D]), TTL_OUT1 (see POWER_BOARD[1D]), TTL_OUT2 (see POWER_BOARD[1D])

### Nets
5VD: C37.2 U10.16(VCC) ; port 5VD
DGND: C35.1 C36.1 C37.1 U10.15(GND)
+8.5V: C36.2 U10.2(VS+) ; port +8.5V  [project net +232]
-8.5V: C35.2 U10.6(VS-) ; port -8.5V  [project net -232]
EIA232_IN1: U10.13(R1IN) ; port EIA232_IN1
EIA232_IN2: U10.8(R2IN) ; port EIA232_IN2
EIA232_OUT1: U10.14(~{T1OUT}) ; port EIA232_OUT1
EIA232_OUT2: U10.7(~{T2OUT}) ; port EIA232_OUT2
TTL_IN1: U10.11(T1IN) ; port TTL_IN1
TTL_IN2: U10.10(T2IN) ; port TTL_IN2
TTL_OUT1: U10.12(~{R1OUT}) ; port TTL_OUT1
TTL_OUT2: U10.9(~{R2OUT}) ; port TTL_OUT2
NetC33_1: C33.1 U10.5(C2-)
NetC33_2: C33.2 U10.4(C2+)
NetC34_1: C34.1 U10.3(C1-)
NetC34_2: C34.2 U10.1(C1+)

### Library data of the parts
C33-C37 = C: as C8 on sheet 1VD, 1.5VD, 1.8VD, 3.3VD, 3.3VA; 联系售后，技术支持: https://shop463601444.taobao.com; 唯一出售店铺网址: https://shop463601444.taobao.com
U10 = CMP-0299-00141-2: Dual EIA-232 Driver / Receiver, 0 to 70 degC, 16-Pin SOIC (DW), Green (RoHS & no Sb/Br); SubFamily: RS-232; Supply Voltage(s)(V): 5; ICC(Max)(mA): 10; RS-232: TRUE; Drivers Per Package: 2; ESD HBM(kV): +/-2; ComponentLink1Description: Manufacturer URL; PackageDescription: 16-Pin Small Outline Integrated Circuit, 10.3 x 7.5 mm, Pitch 1.27 mm Pitch; PackageVersion: revG, Jan-2011; DatasheetVersion: SLLS047L; Single Supply: TRUE; ComponentLink2URL: http://www.ti.com/general/docs/lit/getliterature.tsp?genericPartNumber=MAX232&fileType=pdf; ComponentLink1URL: www.ti.com; ComponentLink3URL: http://www.ti.com/litv/pdf/msoi003g; ComponentLink2Description: Datasheet; Receivers Per Package: 2; PackageReference: DW0016A; ComponentLink3Description: Package Specification

## Sheet CAN收发器.SchDoc
size A4; SheetNumber: 6; SheetTotal: 7
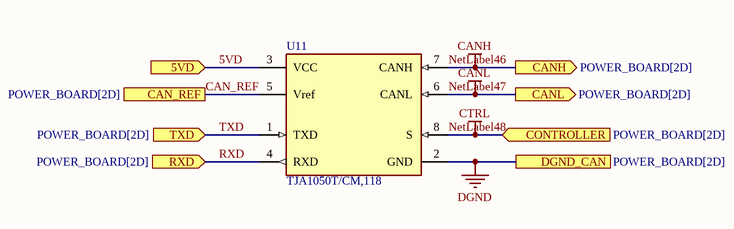
[diagram p5: CAN收发器.SchDoc]

### Parts
U11  TJA1050T/CM,118  [FP-SOT96-1-IPC_A]

### Ports
5VD (in, see POWER_BOARD[2D], 232收发器[2B]), CAN_REF (see POWER_BOARD[2D]), CANH (out, see POWER_BOARD[2D]), CANL (out, see POWER_BOARD[2D]), CONTROLLER (in, see POWER_BOARD[2D]), DGND_CAN (see POWER_BOARD[2D]), RXD (in, see POWER_BOARD[2D]), TXD (in, see POWER_BOARD[2D])

### Nets
5VD: U11.3(VCC) ; port 5VD
DGND: U11.2(GND) ; port DGND_CAN
NetLabel46: U11.7(CANH) ; port CANH  [also labelled CANH]
NetLabel47: U11.6(CANL) ; port CANL  [also labelled CANL]
NetLabel48: U11.8(S) ; port CONTROLLER  [also labelled CTRL]
CAN_REF: U11.5(Vref) ; port CAN_REF
RXD: U11.4(RXD) ; port RXD
TXD: U11.1(TXD) ; port TXD

### Library data of the parts
U11 = CMP-2000-04923-2: IC TRANSCEIVER HALF 1/1 8SO; Simplex/Duplex: Half Duplex; Max Supply Current: 10mA; Number of Receive Buffers: 1; Min Supply Voltage: 4.75V; Max Supply Voltage: 5.25V; Interface: CAN; Data Rate: 1Mbps; Receiver Hysteresis: 70mV; Number of Transmit Buffers: 1; Min Operating Temperature: -40°C; Case/Package: SO; REACH SVHC: No SVHC; Max Operating Temperature: 150°C; Number of Pins: 8; Lead Free: Lead Free; Number of Transceivers: 1; Packaging: Tape and Reel; Mount: Surface Mount; Radiation Hardening: No; Nominal Supply Current: 10mA; Package Quantity: 2500; Contact Plating: Gold

## Sheet PWM_ABZ_MOTOR1_AND_2.SchDoc
size A4; SheetNumber: 7; SheetTotal: 10
Used 2 times, as channels Designator1, Designator2. Parts and nets are listed once, with the designators drawn on the sheet.
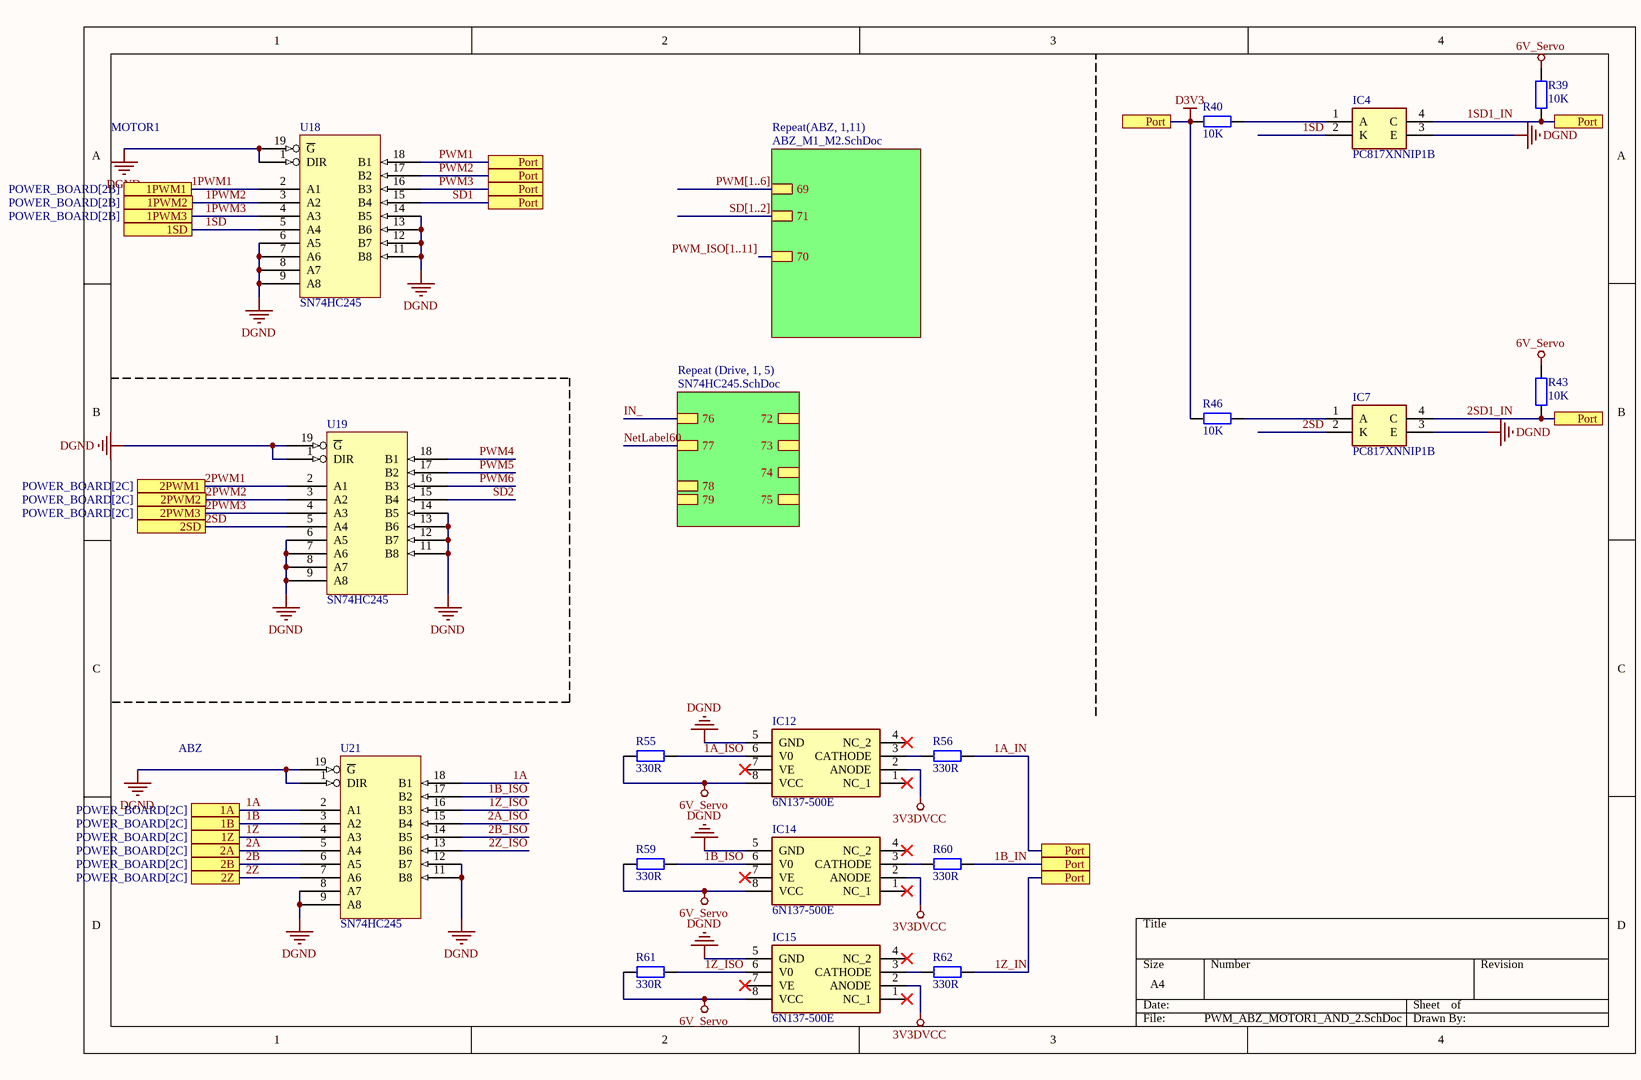
[diagram p6: PWM_ABZ_MOTOR1_AND_2.SchDoc]

### Parts
IC4  PC817XNNIP1B  [SOP254P960X420-4N]
IC7  PC817XNNIP1B  [SOP254P960X420-4N]
IC12  6N137-500E  [SOP254P1030X508-8N]
IC14  6N137-500E  [SOP254P1030X508-8N]
IC15  6N137-500E  [SOP254P1030X508-8N]
R39  10K  [R 0805_L]
R40  10K  [R 0805_L]
R43  10K  [R 0805_L]
R46  10K  [R 0805_L]
R55  330R  [R 0805_L]
R56  330R  [R 0805_L]
R59  330R  [R 0805_L]
R60  330R  [R 0805_L]
R61  330R  [R 0805_L]
R62  330R  [R 0805_L]
U18  SN74HC245  [TSSOP-20]
U19  SN74HC245  [TSSOP-20]
U21  SN74HC245  [TSSOP-20]

### Sub-sheets
Repeat (Drive, 1, 5) = SN74HC245.SchDoc: 72, 73, 74, 75, 76, 77, 78, 79
Repeat(ABZ, 1,11) = ABZ_M1_M2.SchDoc: 69, 70, 71

### Ports
1A (see POWER_BOARD[2C]), 1B (see POWER_BOARD[2C]), 1PWM1 (see POWER_BOARD[2B]), 1PWM2 (see POWER_BOARD[2B]), 1PWM3 (see POWER_BOARD[2B]), 1SD, 1Z (see POWER_BOARD[2C]), 2A (see POWER_BOARD[2C]), 2B (see POWER_BOARD[2C]), 2PWM1 (see POWER_BOARD[2C]), 2PWM2 (see POWER_BOARD[2C]), 2PWM3 (see POWER_BOARD[2C]), 2SD, 2Z (see POWER_BOARD[2C]), Port

### Nets
1A_IN: IC4.4(C) IC7.4(C) R39.1 R40.1 R43.1 R46.1 R56.1 R60.1 R62.1 U18.15(B4) U18.16(B3) U18.17(B2) U18.18(B1) ; port Port  [also labelled 1B_IN, 1SD1_IN, 1Z_IN, 2SD1_IN, D3V3, PWM1, PWM2, PWM3, SD1]
3V3DVCC: IC12.2(ANODE) IC14.2(ANODE) IC15.2(ANODE)
6V_Servo: IC12.8(VCC) IC14.8(VCC) IC15.8(VCC) R39.2 R43.2 R55.1 R59.1 R61.1
DGND: IC4.3(E) IC7.3(E) IC12.5(GND) IC14.5(GND) IC15.5(GND) U18.1(DIR) U18.6(A5) U18.7(A6) U18.8(A7) U18.9(A8) U18.11(B8) U18.12(B7) U18.13(B6) U18.14(B5) U18.19(~{G}) U19.1(DIR) U19.6(A5) U19.7(A6) U19.8(A7) U19.9(A8) U19.11(B8) U19.12(B7) U19.13(B6) U19.14(B5) U19.19(~{G}) U21.1(DIR) U21.8(A7) U21.9(A8) U21.11(B8) U21.12(B7) U21.19(~{G})
GND: U18.10(DGND) U19.10(DGND) U21.10(DGND)
VCC: U18.20(3V3DVCC) U19.20(3V3DVCC) U21.20(3V3DVCC)
1A: U21.2(A1) U21.18(B1) ; port 1A
1A_ISO: IC12.6(V0) R55.2
1B: U21.3(A2) ; port 1B
1B_ISO: IC14.6(V0) R59.2 U21.17(B2)
1PWM1: U18.2(A1) ; port 1PWM1
1PWM2: U18.3(A2) ; port 1PWM2
1PWM3: U18.4(A3) ; port 1PWM3
1SD: IC4.2(K) U18.5(A4) ; port 1SD
1Z: U21.4(A3) ; port 1Z
1Z_ISO: IC15.6(V0) R61.2 U21.16(B3)
2A: U21.5(A4) ; port 2A
2A_ISO: U21.15(B4)
2B: U21.6(A5) ; port 2B
2B_ISO: U21.14(B5)
2PWM1: U19.2(A1) ; port 2PWM1
2PWM2: U19.3(A2) ; port 2PWM2
2PWM3: U19.4(A3) ; port 2PWM3
2SD: IC7.2(K) U19.5(A4) ; port 2SD
2Z: U21.7(A6) ; port 2Z
2Z_ISO: U21.13(B6)
IN_: sheet Repeat (Drive, 1, 5)/76
NetLabel60: sheet Repeat (Drive, 1, 5)/77
PWM4: U19.18(B1)
PWM5: U19.17(B2)
PWM6: U19.16(B3)
PWM[1..6]: sheet Repeat(ABZ, 1,11)/69
PWM_ISO[1..11]: sheet Repeat(ABZ, 1,11)/70
SD2: U19.15(B4)
SD[1..2]: sheet Repeat(ABZ, 1,11)/71
NetIC4_1: IC4.1(A) R40.2
NetIC7_1: IC7.1(A) R46.2
NetIC12_3: IC12.3(CATHODE) R56.2
NetIC14_3: IC14.3(CATHODE) R60.2
NetIC15_3: IC15.3(CATHODE) R62.2

Not connected (* = marked no-connect by the designer): IC12 1(NC_1)* 4(NC_2)* 7(VE)*; IC14 1(NC_1)* 4(NC_2)* 7(VE)*; IC15 1(NC_1)* 4(NC_2)* 7(VE)*

### Channels
Designator1: designators end in _Designator1; ports 1A=1A 1B=1B 1PWM1=1PWM1 1PWM2=1PWM2 1PWM3=1PWM3 1SD=1SD_Designator1 1Z=1Z 2A=2A 2B=2B 2PWM1=2PWM1 2PWM2=2PWM2 2PWM3=2PWM3 2SD=2SD_Designator1 2Z=2Z Port=1A_IN
Designator2: designators end in _Designator2; ports 1A=1A 1B=1B 1PWM1=1PWM1 1PWM2=1PWM2 1PWM3=1PWM3 1SD=1SD_Designator2 1Z=1Z 2A=2A 2B=2B 2PWM1=2PWM1 2PWM2=2PWM2 2PWM3=2PWM3 2SD=2SD_Designator2 2Z=2Z Port=1A_IN

### Notes on the sheet
- MOTOR1
- ABZ

### Library data of the parts
IC4 IC7 = PC817XNNIP1B: Phototransistor; Manufacturer_Name: Sharp Microelectronics; Datasheet Link: https://componentsearchengine.com//PC817XNNIP1B.pdf; Height: 4.2mm; Mouser2 Part Number: 852-PC817XNNIP1B; Mouser2 Price/Stock: https://www.mouser.com/Search/Refine.aspx?Keyword=852-PC817XNNIP1B; Manufacturer_Part_Number: PC817XNNIP1B
IC12 IC14 IC15 = 6N137-500E: Integrated Circuit; Manufacturer_Name: Avago Technologies; Datasheet Link: https://componentsearchengine.com//6N137-500E.pdf; Height: 4.7mm; Mouser2 Part Number: 630-6N137-500E; Mouser2 Price/Stock: https://www.mouser.com/Search/Refine.aspx?Keyword=630-6N137-500E; Manufacturer_Part_Number: 6N137-500E
R39 R40 R43 R46 R55 R56 R59-R62 = R: as R21 on sheet POWER_BOARD; BOM名称: 贴片电阻; 联系售后: https://shop463601444.taobao.com
U18 U19 U21 = SN74HC245: QUAD BUS TRANSCEIVER 3SO

## Sheet ABZ_M1_M2.SchDoc
size A4; SheetNumber: 8; SheetTotal: 9
Used 22 times, as channels Designator1/ABZ1, Designator1/ABZ2, Designator1/ABZ3, Designator1/ABZ4, Designator1/ABZ5, Designator1/ABZ6, Designator1/ABZ7, Designator1/ABZ8, Designator1/ABZ9, Designator1/ABZ10, Designator1/ABZ11, Designator2/ABZ1, Designator2/ABZ2, Designator2/ABZ3, Designator2/ABZ4, Designator2/ABZ5, Designator2/ABZ6, Designator2/ABZ7, Designator2/ABZ8, Designator2/ABZ9, Designator2/ABZ10, Designator2/ABZ11. Parts and nets are listed once, with the designators drawn on the sheet.
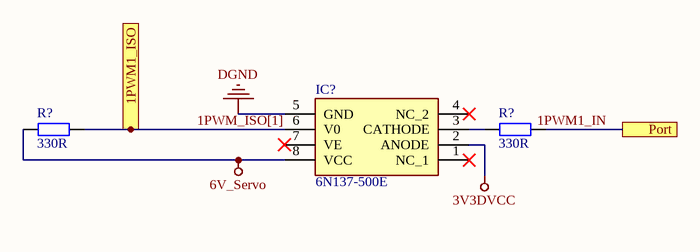
[diagram p7: ABZ_M1_M2.SchDoc]

### Parts
(Parts that share a designator on the sheet are numbered #1, #2 ... from top to bottom, then left to right.)
IC?  6N137-500E  [SOP254P1030X508-8N]
R?#1  330R  [R 0805_L]
R?#2  330R  [R 0805_L]

### Ports
1PWM1_ISO, Port

### Nets
3V3DVCC: IC?.2(ANODE)
6V_Servo: IC?.8(VCC) R?#1.1
DGND: IC?.5(GND)
1PWM1_IN: R?#2.1 ; port Port
1PWM_ISO[1]: IC?.6(V0) R?#1.2 ; port 1PWM1_ISO
NetIC?_3: IC?.3(CATHODE) R?#2.2

Not connected (* = marked no-connect by the designer): IC? 1(NC_1)* 4(NC_2)* 7(VE)*

### Channels
Designator1/ABZ1: designators IC?=IC?_Designator1_ABZ1 R?=R?_Designator1_ABZ1#1 R?=R?_Designator1_ABZ1#2; ports 1PWM1_ISO=1PWM_ISO[1]_ABZ1 Port=1PWM1_IN_ABZ1
Designator1/ABZ2: designators IC?=IC?_Designator1_ABZ2 R?=R?_Designator1_ABZ2#1 R?=R?_Designator1_ABZ2#2; ports 1PWM1_ISO=1PWM_ISO[1]_ABZ2 Port=1PWM1_IN_ABZ2
Designator1/ABZ3: designators IC?=IC?_Designator1_ABZ3 R?=R?_Designator1_ABZ3#1 R?=R?_Designator1_ABZ3#2; ports 1PWM1_ISO=1PWM_ISO[1]_ABZ3 Port=1PWM1_IN_ABZ3
Designator1/ABZ4: designators IC?=IC?_Designator1_ABZ4 R?=R?_Designator1_ABZ4#1 R?=R?_Designator1_ABZ4#2; ports 1PWM1_ISO=1PWM_ISO[1]_ABZ4 Port=1PWM1_IN_ABZ4
Designator1/ABZ5: designators IC?=IC?_Designator1_ABZ5 R?=R?_Designator1_ABZ5#1 R?=R?_Designator1_ABZ5#2; ports 1PWM1_ISO=1PWM_ISO[1]_ABZ5 Port=1PWM1_IN_ABZ5
Designator1/ABZ6: designators IC?=IC?_Designator1_ABZ6 R?=R?_Designator1_ABZ6#1 R?=R?_Designator1_ABZ6#2; ports 1PWM1_ISO=1PWM_ISO[1]_ABZ6 Port=1PWM1_IN_ABZ6
Designator1/ABZ7: designators IC?=IC?_Designator1_ABZ7 R?=R?_Designator1_ABZ7#1 R?=R?_Designator1_ABZ7#2; ports 1PWM1_ISO=1PWM_ISO[1]_ABZ7 Port=1PWM1_IN_ABZ7
Designator1/ABZ8: designators IC?=IC?_Designator1_ABZ8 R?=R?_Designator1_ABZ8#1 R?=R?_Designator1_ABZ8#2; ports 1PWM1_ISO=1PWM_ISO[1]_ABZ8 Port=1PWM1_IN_ABZ8
Designator1/ABZ9: designators IC?=IC?_Designator1_ABZ9 R?=R?_Designator1_ABZ9#1 R?=R?_Designator1_ABZ9#2; ports 1PWM1_ISO=1PWM_ISO[1]_ABZ9 Port=1PWM1_IN_ABZ9
Designator1/ABZ10: designators IC?=IC?_Designator1_ABZ10 R?=R?_Designator1_ABZ10#1 R?=R?_Designator1_ABZ10#2; ports 1PWM1_ISO=1PWM_ISO[1]_ABZ10 Port=1PWM1_IN_ABZ10
Designator1/ABZ11: designators IC?=IC?_Designator1_ABZ11 R?=R?_Designator1_ABZ11#1 R?=R?_Designator1_ABZ11#2; ports 1PWM1_ISO=1PWM_ISO[1]_ABZ11 Port=1PWM1_IN_ABZ11
Designator2/ABZ1: designators IC?=IC?_Designator2_ABZ1 R?=R?_Designator2_ABZ1#1 R?=R?_Designator2_ABZ1#2; ports 1PWM1_ISO=1PWM_ISO[1]_ABZ1 Port=1PWM1_IN_ABZ1
Designator2/ABZ2: designators IC?=IC?_Designator2_ABZ2 R?=R?_Designator2_ABZ2#1 R?=R?_Designator2_ABZ2#2; ports 1PWM1_ISO=1PWM_ISO[1]_ABZ2 Port=1PWM1_IN_ABZ2
Designator2/ABZ3: designators IC?=IC?_Designator2_ABZ3 R?=R?_Designator2_ABZ3#1 R?=R?_Designator2_ABZ3#2; ports 1PWM1_ISO=1PWM_ISO[1]_ABZ3 Port=1PWM1_IN_ABZ3
Designator2/ABZ4: designators IC?=IC?_Designator2_ABZ4 R?=R?_Designator2_ABZ4#1 R?=R?_Designator2_ABZ4#2; ports 1PWM1_ISO=1PWM_ISO[1]_ABZ4 Port=1PWM1_IN_ABZ4
Designator2/ABZ5: designators IC?=IC?_Designator2_ABZ5 R?=R?_Designator2_ABZ5#1 R?=R?_Designator2_ABZ5#2; ports 1PWM1_ISO=1PWM_ISO[1]_ABZ5 Port=1PWM1_IN_ABZ5
Designator2/ABZ6: designators IC?=IC?_Designator2_ABZ6 R?=R?_Designator2_ABZ6#1 R?=R?_Designator2_ABZ6#2; ports 1PWM1_ISO=1PWM_ISO[1]_ABZ6 Port=1PWM1_IN_ABZ6
Designator2/ABZ7: designators IC?=IC?_Designator2_ABZ7 R?=R?_Designator2_ABZ7#1 R?=R?_Designator2_ABZ7#2; ports 1PWM1_ISO=1PWM_ISO[1]_ABZ7 Port=1PWM1_IN_ABZ7
Designator2/ABZ8: designators IC?=IC?_Designator2_ABZ8 R?=R?_Designator2_ABZ8#1 R?=R?_Designator2_ABZ8#2; ports 1PWM1_ISO=1PWM_ISO[1]_ABZ8 Port=1PWM1_IN_ABZ8
Designator2/ABZ9: designators IC?=IC?_Designator2_ABZ9 R?=R?_Designator2_ABZ9#1 R?=R?_Designator2_ABZ9#2; ports 1PWM1_ISO=1PWM_ISO[1]_ABZ9 Port=1PWM1_IN_ABZ9
Designator2/ABZ10: designators IC?=IC?_Designator2_ABZ10 R?=R?_Designator2_ABZ10#1 R?=R?_Designator2_ABZ10#2; ports 1PWM1_ISO=1PWM_ISO[1]_ABZ10 Port=1PWM1_IN_ABZ10
Designator2/ABZ11: designators IC?=IC?_Designator2_ABZ11 R?=R?_Designator2_ABZ11#1 R?=R?_Designator2_ABZ11#2; ports 1PWM1_ISO=1PWM_ISO[1]_ABZ11 Port=1PWM1_IN_ABZ11

### Library data of the parts
IC? = 6N137-500E: as IC12 on sheet PWM_ABZ_MOTOR1_AND_2; Datasheet Link: https://componentsearchengine.com//6N137-500E.pdf; Height: 4.7mm; Mouser2 Part Number: 630-6N137-500E; Mouser2 Price/Stock: https://www.mouser.com/Search/Refine.aspx?Keyword=630-6N137-500E; Manufacturer_Part_Number: 6N137-500E
R?#1 R?#2 = R: as R21 on sheet POWER_BOARD; BOM名称: 贴片电阻; 联系售后: https://shop463601444.taobao.com

## Sheet SN74HC245.SchDoc
size A4; SheetNumber: 10; SheetTotal: 10
Used 10 times, as channels Designator1/Drive1, Designator1/Drive2, Designator1/Drive3, Designator1/Drive4, Designator1/Drive5, Designator2/Drive1, Designator2/Drive2, Designator2/Drive3, Designator2/Drive4, Designator2/Drive5. Parts and nets are listed once, with the designators drawn on the sheet.

### Channels
Designator1/Drive1: no parts or ports
Designator1/Drive2: no parts or ports
Designator1/Drive3: no parts or ports
Designator1/Drive4: no parts or ports
Designator1/Drive5: no parts or ports
Designator2/Drive1: no parts or ports
Designator2/Drive2: no parts or ports
Designator2/Drive3: no parts or ports
Designator2/Drive4: no parts or ports
Designator2/Drive5: no parts or ports

## Sheet PWM_M1_M2.SchDoc
size A4; SheetNumber: 9; SheetTotal: 8
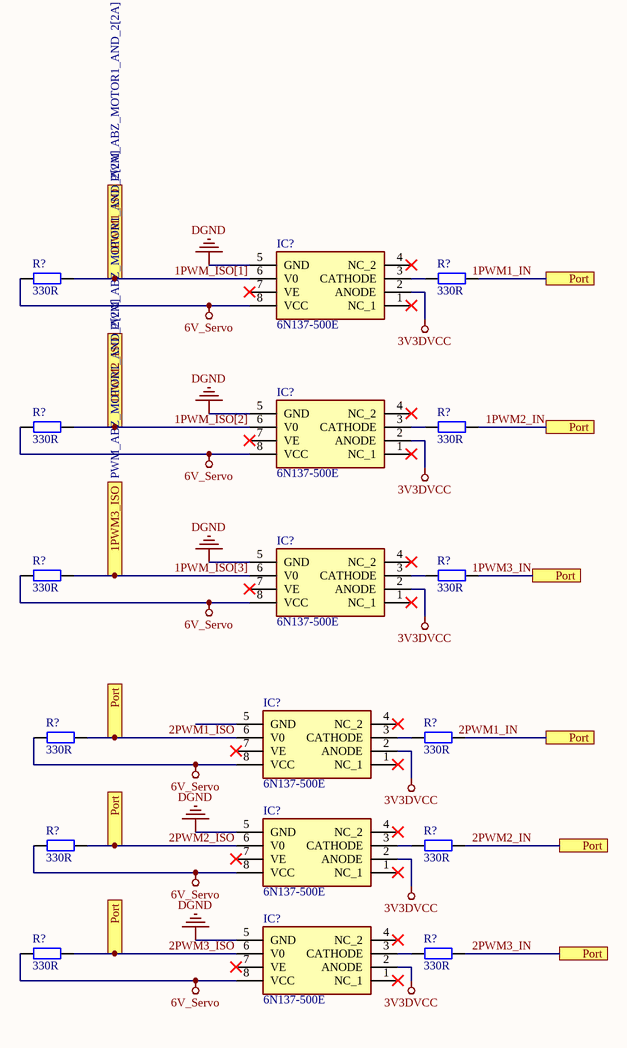
[diagram p8: PWM_M1_M2.SchDoc]

### Parts
(Parts that share a designator on the sheet are numbered #1, #2 ... from top to bottom, then left to right.)
IC?#1  6N137-500E  [SOP254P1030X508-8N]
IC?#2  6N137-500E  [SOP254P1030X508-8N]
IC?#3  6N137-500E  [SOP254P1030X508-8N]
IC?#4  6N137-500E  [SOP254P1030X508-8N]
IC?#5  6N137-500E  [SOP254P1030X508-8N]
IC?#6  6N137-500E  [SOP254P1030X508-8N]
R?#1  330R  [R 0805_L]
R?#2  330R  [R 0805_L]
R?#3  330R  [R 0805_L]
R?#4  330R  [R 0805_L]
R?#5  330R  [R 0805_L]
R?#6  330R  [R 0805_L]
R?#7  330R  [R 0805_L]
R?#8  330R  [R 0805_L]
R?#9  330R  [R 0805_L]
R?#10  330R  [R 0805_L]
R?#11  330R  [R 0805_L]
R?#12  330R  [R 0805_L]

### Ports
1PWM1_ISO (see PWM_ABZ_MOTOR1_AND_2[2A]), 1PWM2_ISO (see PWM_ABZ_MOTOR1_AND_2[2A]), 1PWM3_ISO (see PWM_ABZ_MOTOR1_AND_2[2A]), Port

### Nets
3V3DVCC: IC?#1.2(ANODE) IC?#2.2(ANODE) IC?#3.2(ANODE) IC?#4.2(ANODE) IC?#5.2(ANODE) IC?#6.2(ANODE)
6V_Servo: IC?#1.8(VCC) IC?#2.8(VCC) IC?#3.8(VCC) IC?#4.8(VCC) IC?#5.8(VCC) IC?#6.8(VCC) R?#1.1 R?#3.1 R?#5.1 R?#7.1 R?#9.1 R?#11.1
DGND: IC?#1.5(GND) IC?#2.5(GND) IC?#3.5(GND) IC?#5.5(GND) IC?#6.5(GND)
1PWM1_IN: IC?#4.6(V0) IC?#5.6(V0) IC?#6.6(V0) R?#2.1 R?#4.1 R?#6.1 R?#7.2 R?#8.1 R?#9.2 R?#10.1 R?#11.2 R?#12.1 ; port Port  [also labelled 1PWM2_IN, 1PWM3_IN, 2PWM1_IN, 2PWM1_ISO, 2PWM2_IN, 2PWM2_ISO, 2PWM3_IN, 2PWM3_ISO]
1PWM_ISO[1]: IC?#1.6(V0) R?#1.2 ; port 1PWM1_ISO
1PWM_ISO[2]: IC?#2.6(V0) R?#3.2 ; port 1PWM2_ISO
1PWM_ISO[3]: IC?#3.6(V0) R?#5.2 ; port 1PWM3_ISO
NetIC?#1_3: IC?#1.3(CATHODE) R?#2.2
NetIC?#2_3: IC?#2.3(CATHODE) R?#4.2
NetIC?#3_3: IC?#3.3(CATHODE) R?#6.2
NetIC?#4_3: IC?#4.3(CATHODE) R?#8.2
NetIC?#5_3: IC?#5.3(CATHODE) R?#10.2
NetIC?#6_3: IC?#6.3(CATHODE) R?#12.2

Not connected (* = marked no-connect by the designer): IC?#1 1(NC_1)* 4(NC_2)* 7(VE)*; IC?#2 1(NC_1)* 4(NC_2)* 7(VE)*; IC?#3 1(NC_1)* 4(NC_2)* 7(VE)*; IC?#4 1(NC_1)* 4(NC_2)* 5(GND) 7(VE)*; IC?#5 1(NC_1)* 4(NC_2)* 7(VE)*; IC?#6 1(NC_1)* 4(NC_2)* 7(VE)*

### Library data of the parts
IC?#1-IC?#6 = 6N137-500E: as IC12 on sheet PWM_ABZ_MOTOR1_AND_2; Datasheet Link: https://componentsearchengine.com//6N137-500E.pdf; Height: 4.7mm; Mouser2 Part Number: 630-6N137-500E; Mouser2 Price/Stock: https://www.mouser.com/Search/Refine.aspx?Keyword=630-6N137-500E; Manufacturer_Part_Number: 6N137-500E
R?#1-R?#12 = R: as R21 on sheet POWER_BOARD; BOM名称: 贴片电阻; 联系售后: https://shop463601444.taobao.com

## Nets that join several sheets
1.5VD: 1VD, 1.5VD, 1.8VD, 3.3VD, 3.3VA (5 pins), VTTVREF (C43.2 U8.1 U8.2)
1A_IN: 1VD, 1.5VD, 1.8VD, 3.3VD, 3.3VA (C10.2 C11.2 L3.2), Designator1 (13 pins), Designator2 (13 pins)
3V3DVCC: Designator1 (IC12_Designator1.2 IC14_Designator1.2 IC15_Designator1.2), Designator1/ABZ1 (IC?_Designator1_ABZ1.2), Designator1/ABZ2 (IC?_Designator1_ABZ2.2), Designator1/ABZ3 (IC?_Designator1_ABZ3.2), Designator1/ABZ4 (IC?_Designator1_ABZ4.2), Designator1/ABZ5 (IC?_Designator1_ABZ5.2), Designator1/ABZ6 (IC?_Designator1_ABZ6.2), Designator1/ABZ7 (IC?_Designator1_ABZ7.2), Designator1/ABZ8 (IC?_Designator1_ABZ8.2), Designator1/ABZ9 (IC?_Designator1_ABZ9.2), Designator1/ABZ10 (IC?_Designator1_ABZ10.2), Designator1/ABZ11 (IC?_Designator1_ABZ11.2), Designator2 (IC12_Designator2.2 IC14_Designator2.2 IC15_Designator2.2), Designator2/ABZ1 (IC?_Designator2_ABZ1.2), Designator2/ABZ2 (IC?_Designator2_ABZ2.2), Designator2/ABZ3 (IC?_Designator2_ABZ3.2), Designator2/ABZ4 (IC?_Designator2_ABZ4.2), Designator2/ABZ5 (IC?_Designator2_ABZ5.2), Designator2/ABZ6 (IC?_Designator2_ABZ6.2), Designator2/ABZ7 (IC?_Designator2_ABZ7.2), Designator2/ABZ8 (IC?_Designator2_ABZ8.2), Designator2/ABZ9 (IC?_Designator2_ABZ9.2), Designator2/ABZ10 (IC?_Designator2_ABZ10.2), Designator2/ABZ11 (IC?_Designator2_ABZ11.2), PWM_M1_M2 (6 pins)
5VD: 1VD, 1.5VD, 1.8VD, 3.3VD, 3.3VA (26 pins), VTTVREF (C44.2 U8.10), 5VD_and_5VDC_and_12V (C54.1 C55.1 U13.4), 232收发器 (C37.2 U10.16), CAN收发器 (U11.3)
6V_Servo: Designator1 (8 pins), Designator1/ABZ1 (IC?_Designator1_ABZ1.8 R?_Designator1_ABZ1#1.1), Designator1/ABZ2 (IC?_Designator1_ABZ2.8 R?_Designator1_ABZ2#1.1), Designator1/ABZ3 (IC?_Designator1_ABZ3.8 R?_Designator1_ABZ3#1.1), Designator1/ABZ4 (IC?_Designator1_ABZ4.8 R?_Designator1_ABZ4#1.1), Designator1/ABZ5 (IC?_Designator1_ABZ5.8 R?_Designator1_ABZ5#1.1), Designator1/ABZ6 (IC?_Designator1_ABZ6.8 R?_Designator1_ABZ6#1.1), Designator1/ABZ7 (IC?_Designator1_ABZ7.8 R?_Designator1_ABZ7#1.1), Designator1/ABZ8 (IC?_Designator1_ABZ8.8 R?_Designator1_ABZ8#1.1), Designator1/ABZ9 (IC?_Designator1_ABZ9.8 R?_Designator1_ABZ9#1.1), Designator1/ABZ10 (IC?_Designator1_ABZ10.8 R?_Designator1_ABZ10#1.1), Designator1/ABZ11 (IC?_Designator1_ABZ11.8 R?_Designator1_ABZ11#1.1), Designator2 (8 pins), Designator2/ABZ1 (IC?_Designator2_ABZ1.8 R?_Designator2_ABZ1#1.1), Designator2/ABZ2 (IC?_Designator2_ABZ2.8 R?_Designator2_ABZ2#1.1), Designator2/ABZ3 (IC?_Designator2_ABZ3.8 R?_Designator2_ABZ3#1.1), Designator2/ABZ4 (IC?_Designator2_ABZ4.8 R?_Designator2_ABZ4#1.1), Designator2/ABZ5 (IC?_Designator2_ABZ5.8 R?_Designator2_ABZ5#1.1), Designator2/ABZ6 (IC?_Designator2_ABZ6.8 R?_Designator2_ABZ6#1.1), Designator2/ABZ7 (IC?_Designator2_ABZ7.8 R?_Designator2_ABZ7#1.1), Designator2/ABZ8 (IC?_Designator2_ABZ8.8 R?_Designator2_ABZ8#1.1), Designator2/ABZ9 (IC?_Designator2_ABZ9.8 R?_Designator2_ABZ9#1.1), Designator2/ABZ10 (IC?_Designator2_ABZ10.8 R?_Designator2_ABZ10#1.1), Designator2/ABZ11 (IC?_Designator2_ABZ11.8 R?_Designator2_ABZ11#1.1), PWM_M1_M2 (12 pins)
AGND: POWER_BOARD (5 pins), 5VD_and_5VDC_and_12V (14 pins)
DGND: POWER_BOARD (5 pins), 5VD_and_5VDC_and_12V (13 pins), 232收发器 (C35.1 C36.1 C37.1 U10.15), CAN收发器 (U11.2), Designator1 (31 pins), Designator1/ABZ1 (IC?_Designator1_ABZ1.5), Designator1/ABZ2 (IC?_Designator1_ABZ2.5), Designator1/ABZ3 (IC?_Designator1_ABZ3.5), Designator1/ABZ4 (IC?_Designator1_ABZ4.5), Designator1/ABZ5 (IC?_Designator1_ABZ5.5), Designator1/ABZ6 (IC?_Designator1_ABZ6.5), Designator1/ABZ7 (IC?_Designator1_ABZ7.5), Designator1/ABZ8 (IC?_Designator1_ABZ8.5), Designator1/ABZ9 (IC?_Designator1_ABZ9.5), Designator1/ABZ10 (IC?_Designator1_ABZ10.5), Designator1/ABZ11 (IC?_Designator1_ABZ11.5), Designator2 (31 pins), Designator2/ABZ1 (IC?_Designator2_ABZ1.5), Designator2/ABZ2 (IC?_Designator2_ABZ2.5), Designator2/ABZ3 (IC?_Designator2_ABZ3.5), Designator2/ABZ4 (IC?_Designator2_ABZ4.5), Designator2/ABZ5 (IC?_Designator2_ABZ5.5), Designator2/ABZ6 (IC?_Designator2_ABZ6.5), Designator2/ABZ7 (IC?_Designator2_ABZ7.5), Designator2/ABZ8 (IC?_Designator2_ABZ8.5), Designator2/ABZ9 (IC?_Designator2_ABZ9.5), Designator2/ABZ10 (IC?_Designator2_ABZ10.5), Designator2/ABZ11 (IC?_Designator2_ABZ11.5), PWM_M1_M2 (5 pins)
GND: 1VD, 1.5VD, 1.8VD, 3.3VD, 3.3VA (51 pins), VTTVREF (C42.1 C43.1 C44.1 U8.8), Designator1 (U18_Designator1.10 U19_Designator1.10 U21_Designator1.10), Designator2 (U18_Designator2.10 U19_Designator2.10 U21_Designator2.10)
VCC: Designator1 (U18_Designator1.20 U19_Designator1.20 U21_Designator1.20), Designator2 (U18_Designator2.20 U19_Designator2.20 U21_Designator2.20)
1A: Designator1 (U21_Designator1.2 U21_Designator1.18), Designator2 (U21_Designator2.2 U21_Designator2.18)
1B: Designator1 (U21_Designator1.3), Designator2 (U21_Designator2.3)
1PWM1: Designator1 (U18_Designator1.2), Designator2 (U18_Designator2.2)
1PWM2: Designator1 (U18_Designator1.3), Designator2 (U18_Designator2.3)
1PWM3: Designator1 (U18_Designator1.4), Designator2 (U18_Designator2.4)
1Z: Designator1 (U21_Designator1.4), Designator2 (U21_Designator2.4)
2A: Designator1 (U21_Designator1.5), Designator2 (U21_Designator2.5)
2B: Designator1 (U21_Designator1.6), Designator2 (U21_Designator2.6)
2PWM1: Designator1 (U19_Designator1.2), Designator2 (U19_Designator2.2)
2PWM2: Designator1 (U19_Designator1.3), Designator2 (U19_Designator2.3)
2PWM3: Designator1 (U19_Designator1.4), Designator2 (U19_Designator2.4)
2Z: Designator1 (U21_Designator1.7), Designator2 (U21_Designator2.7)